# EAGLE design ADSR2 (EAGLE 7.6.0)
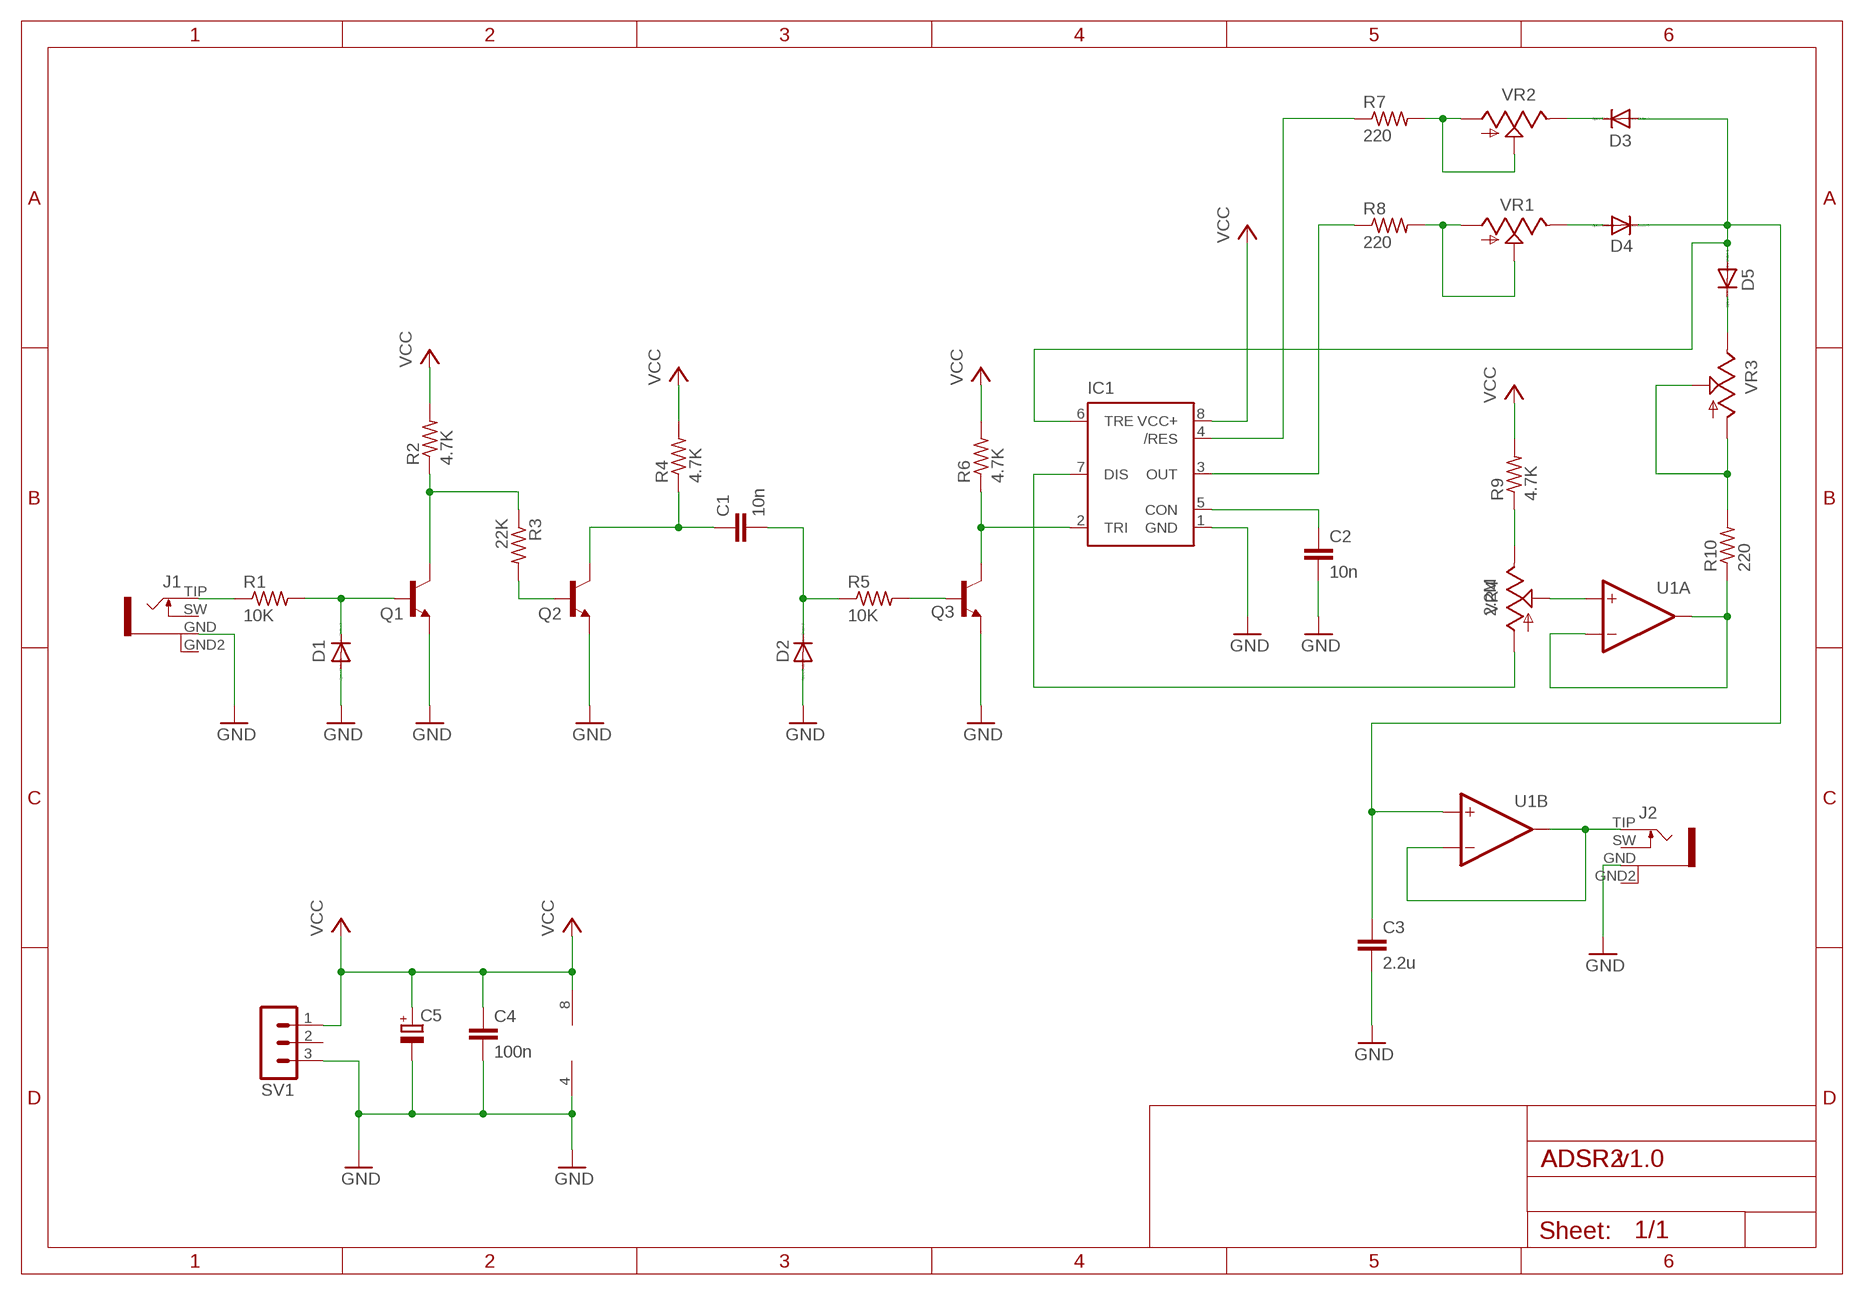
[diagram p0: schematic, sheet 1]

## Parts
C1  10n  C-EU025-025X050  [C025-025X050]
C2  10n  C-EU025-025X050  [C025-025X050]
C3  2.2u  C-EU025-025X050  [C025-025X050]
C4  100n  C-EU025-025X050  [C025-025X050]
C5  CPOL-EUE2,5-6E  [E2,5-6E]
D1  1N4148DO35-7  [DO35-7]
D2  1N4148DO35-7  [DO35-7]
D3  1N4148DO35-7  [DO35-7]
D4  1N4148DO35-7  [DO35-7]
D5  1N4148DO35-7  [DO35-7]
IC1  555  555P  [DIP08]
J1  PJ301WQP  [THONK_JACK_P]
J2  PJ301WQP  [THONK_JACK_P]
Q1  2N3904_TO92  [TO92-EBC]
Q2  2N3904_TO92  [TO92-EBC]
Q3  2N3904_TO92  [TO92-EBC]
R1  10K  R-US_0207/10  [0207/10]
R2  4.7K  R-US_0207/10  [0207/10]
R3  22K  R-US_0207/10  [0207/10]
R4  4.7K  R-US_0207/10  [0207/10]
R5  10K  R-US_0207/10  [0207/10]
R6  4.7K  R-US_0207/10  [0207/10]
R7  220  R-US_0207/10  [0207/10]
R8  220  R-US_0207/10  [0207/10]
R9  4.7K  R-US_0207/10  [0207/10]
R10  220  R-US_0207/10  [0207/10]
SV1  MA03-1  [MA03-1]
U1  TL072_DIL08  [DIL08]
VR1  9MM_SNAP-IN_POT_  [9MM_SNAP-IN_POT]
VR2  9MM_SNAP-IN_POT_  [9MM_SNAP-IN_POT]
VR3  9MM_SNAP-IN_POT_  [9MM_SNAP-IN_POT]
VR4  2.2M  9MM_SNAP-IN_POT_  [9MM_SNAP-IN_POT]

## Nets
GND: C2.2 C3.2 C4.2 C5.- D1.A D2.A IC1.1(GND) J1.GND J2.GND Q1.E Q2.E Q3.E SV1.3 U1.4(P:V-)
N$1: J1.TIP R1.1
N$2: D1.C Q1.B R1.2
N$3: Q2.B R3.2
N$4: Q3.B R5.2
N$5: C1.1 Q2.C R4.1
N$6: Q1.C R2.1 R3.1
N$7: C1.2 D2.C R5.1
N$8: IC1.2(TRI) Q3.C R6.1
N$9: C2.1 IC1.5(CON)
N$10: R8.2 VR1.1(A) VR1.2(S)
N$11: R7.2 VR2.1(A) VR2.2(S)
N$12: D3.C VR2.3(E)
N$13: D4.A VR1.3(E)
N$14: IC1.3(OUT) R8.1
N$15: IC1.4(/RES) R7.1
N$16: J2.TIP U1.6(B:-IN) U1.7(B:OUT)
N$17: R10.2 VR3.1(A) VR3.2(S)
N$18: D5.C VR3.3(E)
N$19: IC1.7(DIS) VR4.1(A)
N$20: C3.1 D3.A D4.C D5.A IC1.6(TRE) U1.5(B:+IN)
N$21: U1.3(A:+IN) VR4.2(S)
N$22: R10.1 U1.1(A:OUT) U1.2(A:-IN)
N$23: R9.1 VR4.3(E)
VCC: C4.1 C5.+ IC1.8(VCC+) R2.2 R4.2 R6.2 R9.2 SV1.1 U1.8(P:V+)
Unconnected: J1.GND2 J1.SW J2.GND2 J2.SW SV1.2

## Notes on the sheet
- ADSR v1.0

## Library data of the parts
C1-C4 = resistor:C-EU: CAPACITOR, European symbol
C5 = resistor:CPOL-EU: POLARIZED CAPACITOR, European symbol
D1-D5 = diode:1N4148: DIODE high speed (Philips)
IC1 = SparkFun-IC-Special-Function:555: General purpose bipolar Timer Datasheet <http://www.sparkfun.com/datasheets/Components/General/ne555.pdf> SparkFun Products SparkFun SparkPunk Sequencer Kit <https://www.sparkfun.com/products/12707> (KIT-12707) Storefront Component: 555 Timer <https://www.sparkfun.com/products/9273> (COM-09273) Two parts valid for production: VFP: IC-11930 (M7555 PTH) VFP: IC-09173 (555 PTH) - Preferred; PROD_ID: IC-09173; PROD_ID_ALT: IC-09173
J1 J2 = tim:PJ301
Q1-Q3 = tim:2N3904: NPN Transistor
R1-R10 = resistor:R-US_: RESISTOR, American symbol
SV1 = con-lstb:MA03-1: PIN HEADER; OC_FARNELL: unknown; OC_NEWARK: unknown
U1 = tim:TL072: Generic Dual Op Amp
VR1-VR4 = tim:9MM_SNAP-IN_POT: 9mm vertical snap-in pot, Alpha / Panasonic style

## Board
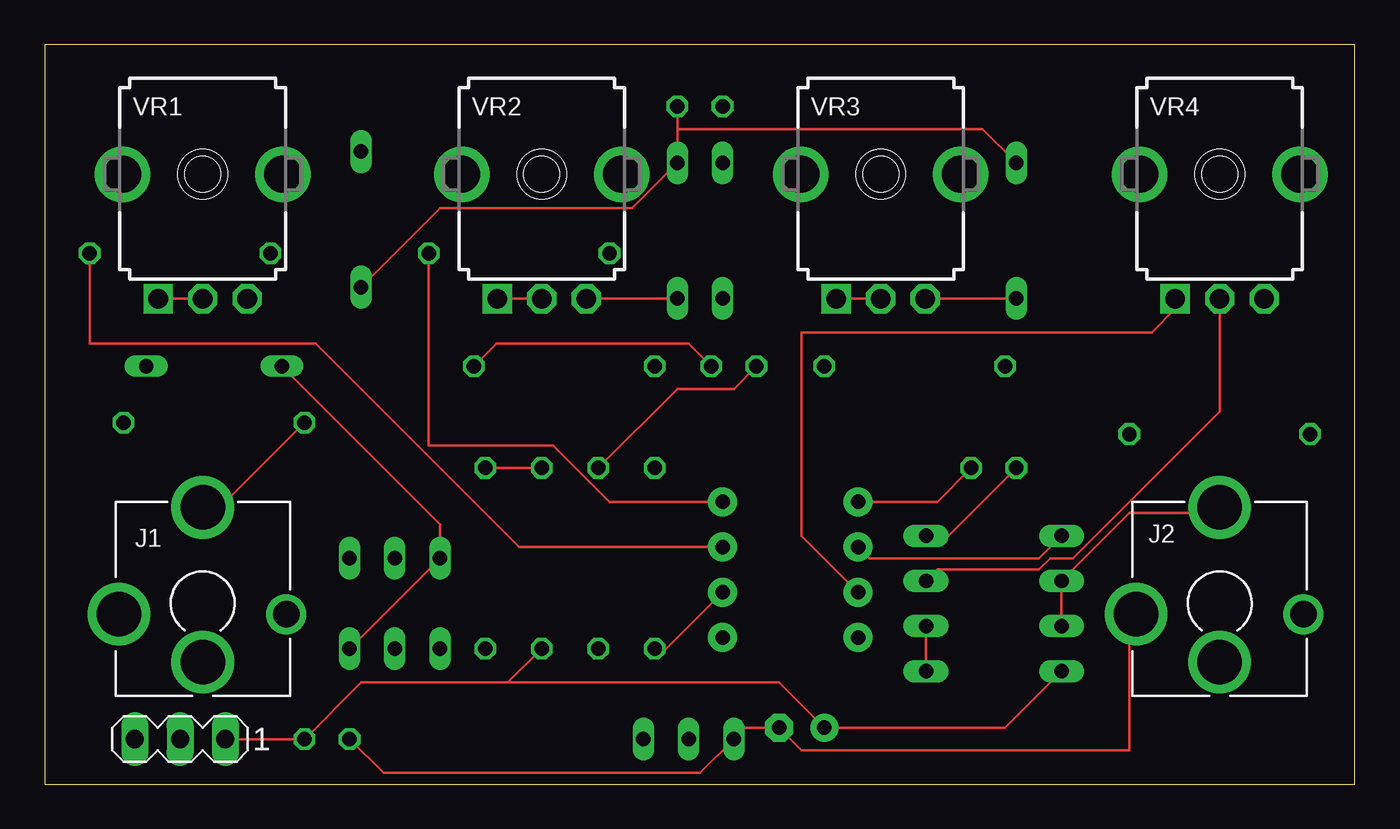
[diagram p1: board, top side]
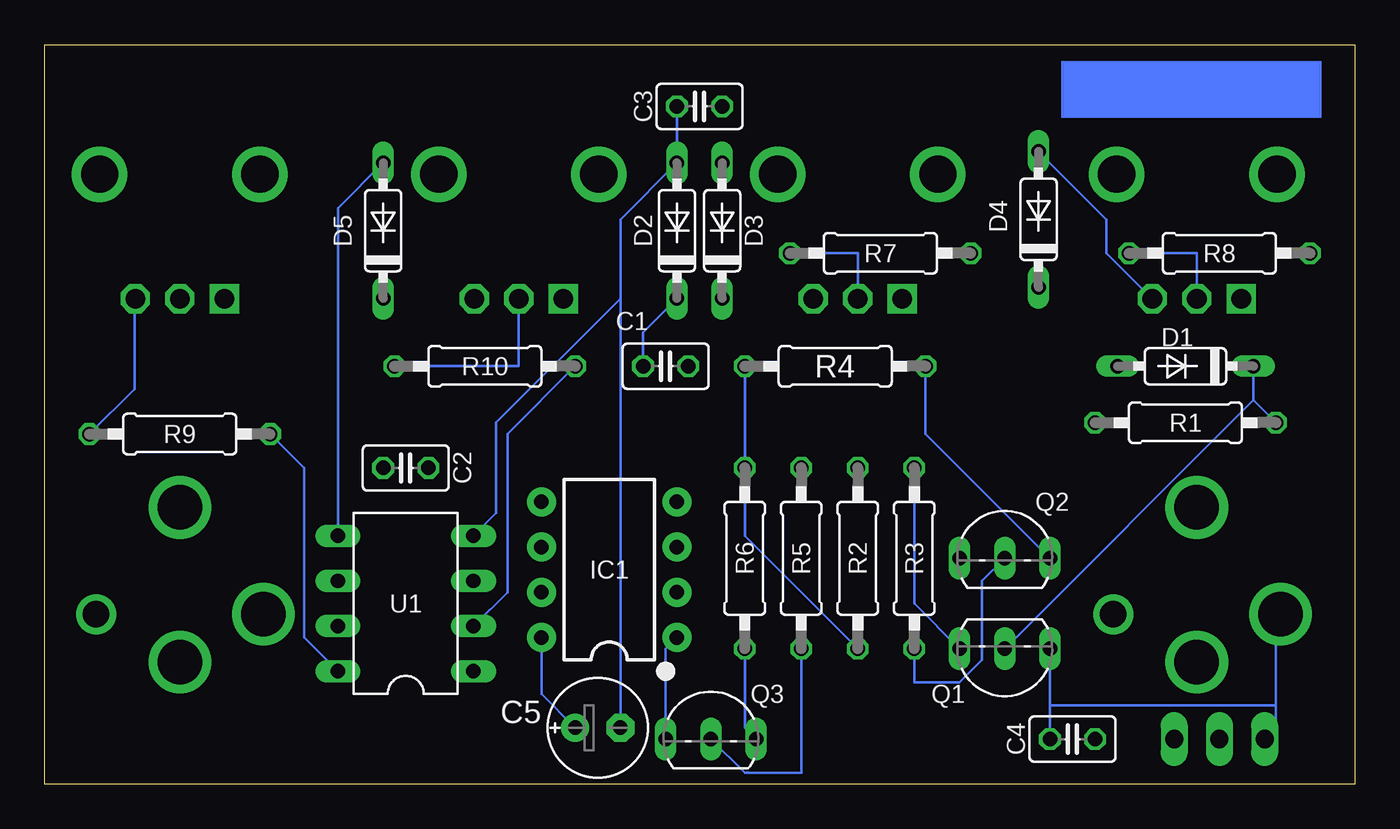
[diagram p2: board, bottom side, seen from below]

Size 73.64 x 41.58 mm. Coordinates in mm from the lower left corner, seen from the top.
Outline: 0,0 73.64,0 73.64,41.58 0,41.58 0,0
Copper layers (1*16): Top 0.035559375mm / dielectric 1.6mm / Bottom 0.035559375mm
Design rules "jlcpcb2layer": minimum track width 5mil, minimum drill 12mil, track to track 5mil, track to pad 5mil, pad to pad 5mil, via to via 5mil, smd to smd 5mil, copper to edge 8mil, drill to drill 6mil, minimum pad ring 5mil, minimum via ring 3mil, stop-mask expansion 2.5mil, vias tented up to drill 0mil, thermal gap 10mil

### Footprints (pad centres in the part's own frame; a part is rotated, then mirrored left to right if it is on the bottom)
C025-025X050 = drill 0.813 octagon: 1 -1.27,0; 2 1.27,0
E2,5-6E = drill 0.813 pad 1.575: + -1.27,0 | drill 0.813 pad 1.575 octagon: - 1.27,0
DO35-7 = drill 0.813 long: A 3.81,0; C -3.81,0
DIP08 = drill 0.813 pad 1.626: 1 -3.81,-3.81; 2 -1.27,-3.81; 3 1.27,-3.81; 4 3.81,-3.81; 5 3.81,3.81; 6 1.27,3.81; 7 -1.27,3.81; 8 -3.81,3.81
THONK_JACK_P = drill 2.5: GND -4.7,-0.6; SW 0,-3.3; TIP 0,5.4 | drill 1.5: GND2 4.7,-0.6
TO92-EBC = drill 0.813 long: B 0,-1.27; C 2.54,-1.27; E -2.54,-1.27
0207/10 = drill 0.813 octagon: 1 -5.08,0; 2 5.08,0
MA03-1 = drill 1.016 long: 1 -2.54,0; 2 0,0; 3 2.54,0
DIL08 = drill 0.813 pad 1.27 long: 1 -3.81,-3.81; 2 -1.27,-3.81; 3 1.27,-3.81; 4 3.81,-3.81; 5 3.81,3.81; 6 1.27,3.81; 7 -1.27,3.81; 8 -3.81,3.81
9MM_SNAP-IN_POT = drill 1.1 square: 1 -2.5,-7 | drill 1.1 octagon: 2 0,-7; 3 2.5,-7 | drill 2.1 pad 2.794: CHASSIS1 -4.5,0; CHASSIS2 4.5,0

### Placement (x,y rotation side)
C1  38.73,23.5 180 bottom
C2  53.34,17.78 180 bottom
C3  36.83,38.1 180 bottom
C4  15.88,2.54 180 bottom
C5  42.55,3.17 0 bottom
D1  9.53,23.5 180 bottom
D2  38.1,31.11 90 bottom
D3  35.56,31.11 90 bottom
D4  17.78,31.75 90 bottom
D5  54.61,31.11 90 bottom
IC1  41.91,12.06 90 bottom
J1  8.89,10.16 0 top
J2  66.04,10.16 0 top
Q1  19.68,6.35 180 bottom
Q2  19.68,13.97 0 bottom
Q3  36.2,3.81 0 bottom
R1  9.53,20.32 0 bottom
R2  27.94,12.7 270 bottom
R3  24.77,12.7 270 bottom
R4  29.21,23.5 180 bottom
R5  31.11,12.7 270 bottom
R6  34.29,12.7 90 bottom
R7  26.67,29.84 180 bottom
R8  7.62,29.84 180 bottom
R9  66.04,19.68 0 bottom
R10  48.9,23.5 180 bottom
SV1  7.62,2.54 180 top
U1  53.34,10.16 90 bottom
VR1  8.89,34.29 0 top
VR2  27.94,34.29 0 top
VR3  46.99,34.29 0 top
VR4  66.04,34.29 0 top

### Tracks (layer width: path | path; a pad name or v marks a point on that pad's centre or on a via)
GND
  Top 0.127: Q1.E Q2.E 22.23,14.61 D1.A | C2.2 50.8,13.97 U1.4 | J2.GND 60.96,9.53 60.96,1.91 42.55,1.91 C5.- 39.37,3.17 Q3.E 36.83,0.64 19.05,0.64 C4.2
  Bottom 0.127: SV1.3 4.45,3.17 4.45,4.45 | 4.45,4.45 4.45,9.53 J1.GND | Q1.E 17.14,4.45 | 17.14,4.45 C4.2 | 17.14,4.45 4.45,4.45 | C3.2 D2.A 41.27,31.75 41.27,27.3 | IC1.1 38.73,7.62 Q3.E | C5.- 41.27,27.3 | U1.4 48.26,15.24 48.26,20.32 41.27,27.3
N$1
  Top 0.127: R1.1 10.16,15.88 8.89,15.88 J1.TIP
N$2
  Bottom 0.127: 5.71,21.59 R1.2 | D1.C 5.71,21.59 | 5.71,21.59 Q1.B
N$3
  Bottom 0.127: Q2.B 20.95,11.43 20.95,6.99 22.23,5.71 24.77,5.71 R3.2
N$4
  Bottom 0.127: Q3.B 34.29,0.64 31.11,0.64 R5.2
N$5
  Top 0.127: C1.1 36.2,24.77 25.4,24.77 R4.1
  Bottom 0.127: Q2.C 24.13,19.68 R4.1
N$6
  Top 0.127: R3.1 R2.1
  Bottom 0.127: Q1.C 24.77,10.16 R3.1
N$7
  Top 0.127: R5.1 35.56,22.23 38.73,22.23 C1.2
  Bottom 0.127: D2.C 40.01,25.4 C1.2
N$8
  Top 0.127: IC1.2 34.92,7.62 R6.1
  Bottom 0.127: Q3.C 34.29,3.17 R6.1
N$9
  Top 0.127: C2.1 50.16,15.88 IC1.5
N$10
  Top 0.127: VR1.1 6.99,27.3 8.89,27.3 VR1.2
  Bottom 0.127: R8.2 8.89,29.84 VR1.2
N$11
  Top 0.127: VR2.1 26.04,27.3 27.94,27.3 VR2.2
  Bottom 0.127: R7.2 27.94,29.84 VR2.2
N$12
  Top 0.127: D3.C 30.48,27.3 VR2.3
N$13
  Bottom 0.127: D4.A 13.97,31.75 13.97,29.84 11.43,27.3 VR1.3
N$14
  Top 0.127: R8.1 2.54,24.77 15.24,24.77 26.67,13.34 IC1.3
N$15
  Top 0.127: R7.1 21.59,19.05 28.57,19.05 31.75,15.88 IC1.4
N$16
  Top 0.127: U1.7 U1.6 60.96,15.24 66.04,15.24 J2.TIP
N$17
  Top 0.127: VR3.1 45.09,27.3 46.99,27.3 VR3.2
  Bottom 0.127: R10.2 46.99,23.5 VR3.2
N$18
  Top 0.127: D5.C 49.53,27.3 VR3.3
N$19
  Top 0.127: IC1.7 42.55,13.97 42.55,25.4 62.23,25.4 63.5,26.67 VR4.1
N$20
  Top 0.127: D4.C 22.23,32.38 33.02,32.38 D3.A 35.56,36.83 | 35.56,36.83 C3.1 | IC1.6 46.35,12.7 55.88,12.7 U1.5 | 35.56,36.83 52.7,36.83 D5.A
  Bottom 0.127: D5.A 57.15,32.38 U1.5
N$21
  Top 0.127: U1.3 50.16,12.06 55.88,12.06 56.52,12.7 57.78,12.7 66.04,20.95 VR4.2
N$22
  Top 0.127: U1.2 U1.1
  Bottom 0.127: R10.1 47.62,19.68 47.62,10.79 U1.2
N$23
  Bottom 0.127: R9.1 68.58,22.23 68.58,26.67 VR4.3
VCC
  Top 0.127: SV1.1 C4.1 17.78,5.71 26.04,5.71 | R2.2 26.04,5.71 | 26.04,5.71 41.27,5.71 C5.+ 53.98,3.17 U1.8
  Bottom 0.127: R9.2 59.05,17.78 59.05,8.26 U1.8 | C5.+ 45.72,5.08 IC1.8 | R2.2 34.29,13.97 R6.2 R4.2
(copper drawn outside any net)
  shapes: Bottom area x1

### Text on the board
bStop: ADSR v1.0